# Altium schematic sheet LED Ribbon.SchDoc: WiFI Camera
size A4; Revision: Rev 3.0; SheetNumber: 1
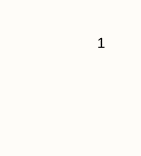
[diagram p0: LED Ribbon.SchDoc, top right]
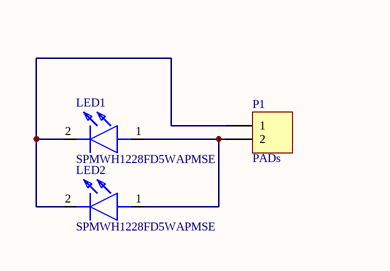
[diagram p1: LED Ribbon.SchDoc, bottom left]

## Parts
LED1  SPMWH1228FD5WAPMSE  [SPMWH1228FD5WAPMSE]
LED2  SPMWH1228FD5WAPMSE  [SPMWH1228FD5WAPMSE]
P1  PADs  [HDR1X2]

## Nets
NetLED1_1: LED1.1(A) LED2.1(A) P1.2
NetLED1_2: LED1.2(K) LED2.2(K) P1.1

## Notes on the sheet
- 1
- Title
- Size:
- Date:
- A4
- Number:
- Time:
- Revision:
- Sheet
- of
- File:

## Library data of the parts
LED1 LED2 = SPMWH1228FD5WAPMSE: LED; Manufacturer_Name: SAMSUNG; Datasheet Link: https://datasheet.datasheetarchive.com/originals/distributors/DKDS-18/357873.pdf; Height: 0.65mm; Manufacturer_Part_Number: SPMWH1228FD5WAPMSE; Arrow Part Number: SPMWH1228FD5WAPMSE; Arrow Price/Stock: https://www.arrow.com/en/products/spmwh1228fd5wapmse/samsung-electronics
P1 = Header 2: Header, 2-Pin; LatestRevisionDate: 17-Jul-2002; LatestRevisionNote: Re-released for DXP Platform.; Publisher: Altium Limited